# EAGLE design M705J (EAGLE 6.6.0)
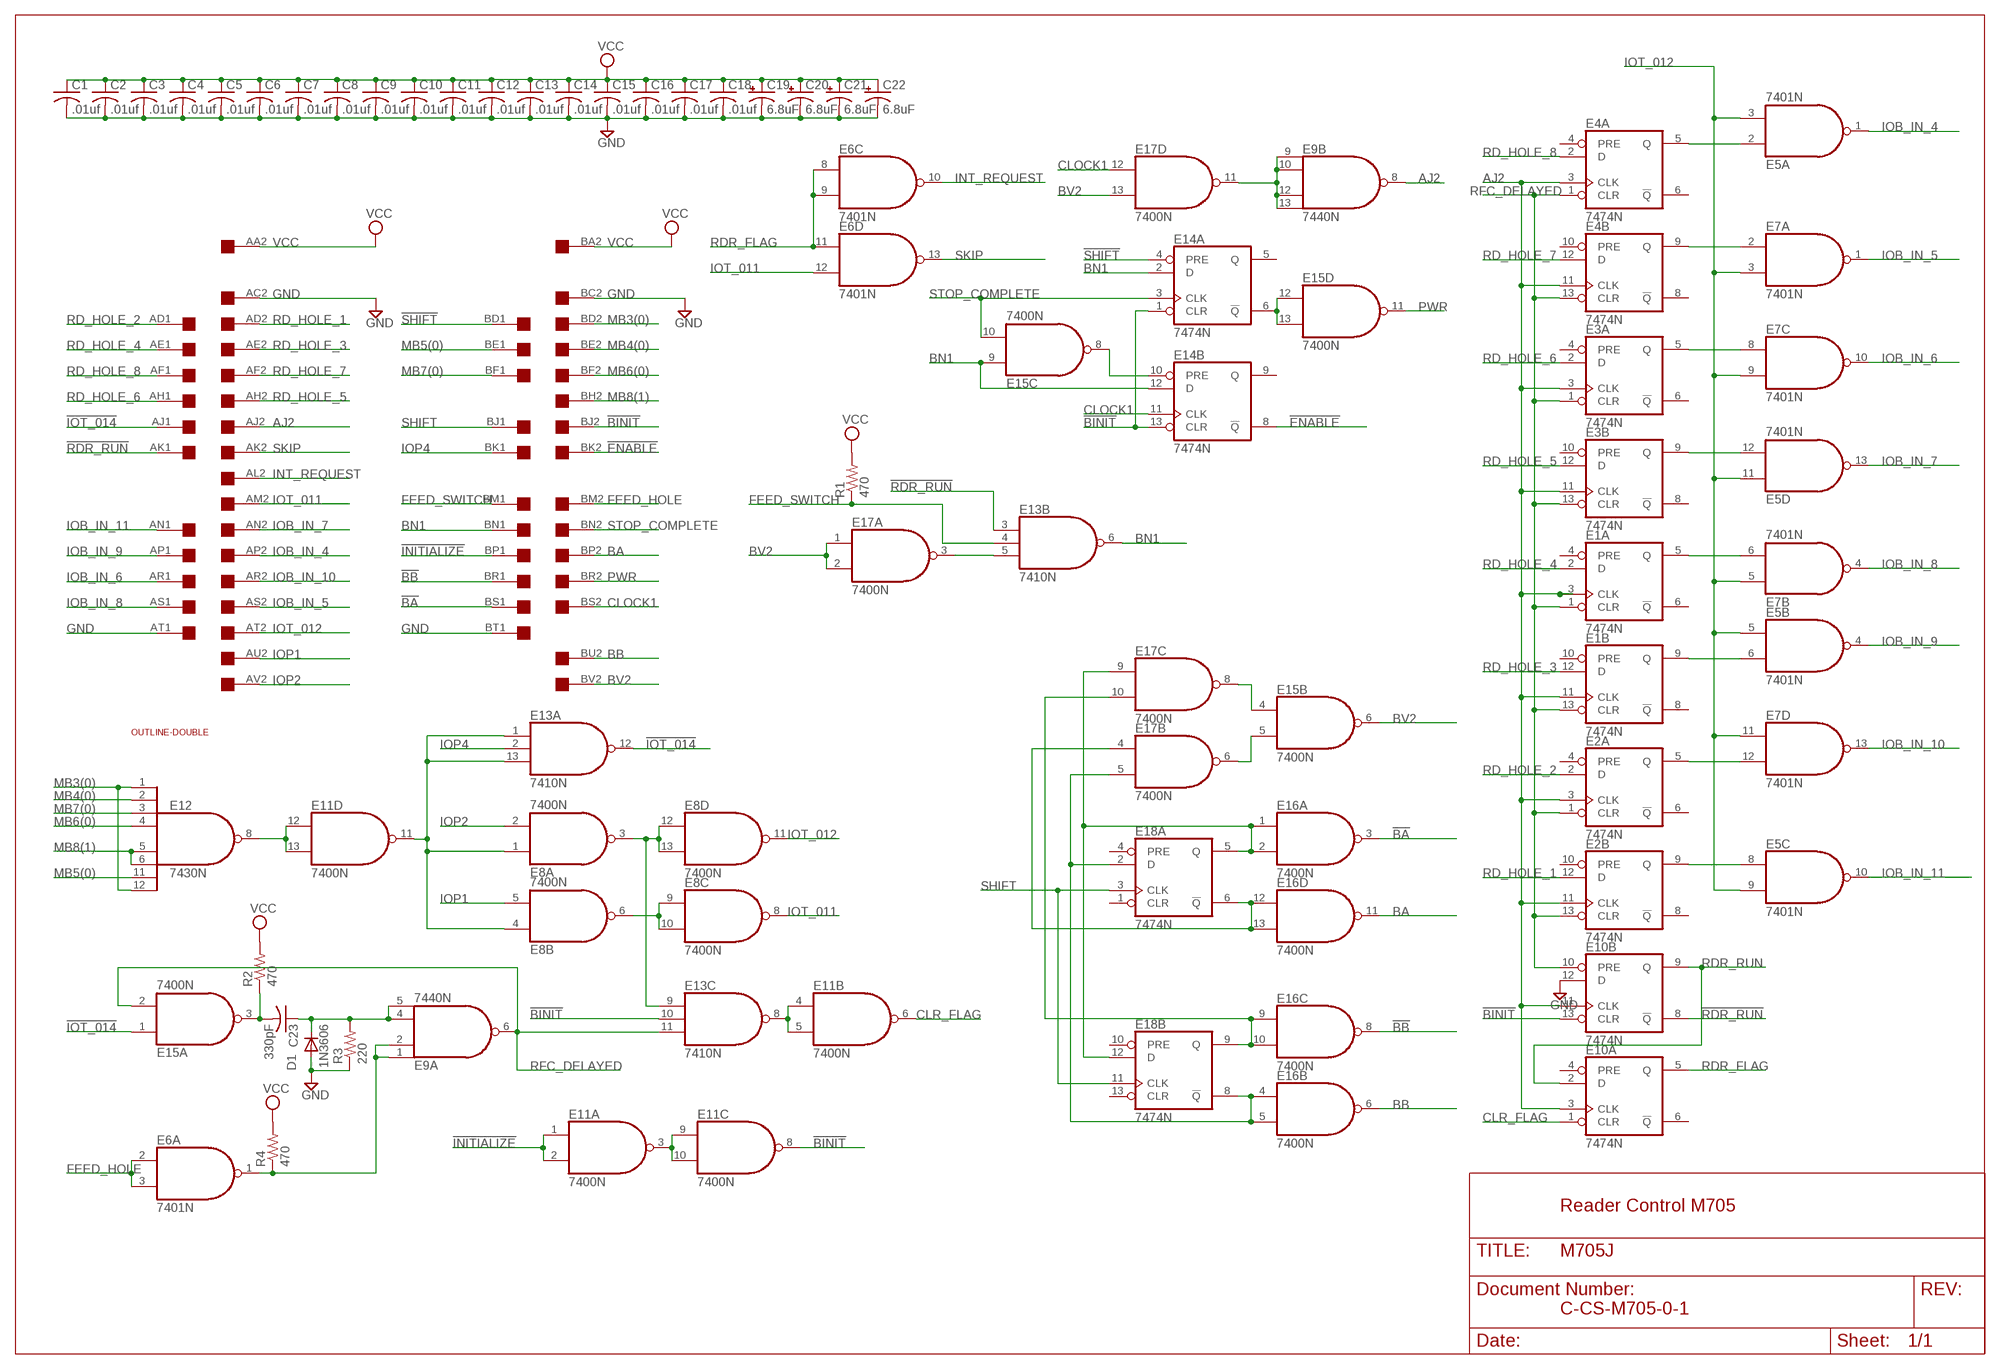
[diagram p0: schematic, sheet 1]

## Parts
C1  .01uf  C-US075-032X103  [C075-032X103]
C2  .01uf  C-US075-032X103  [C075-032X103]
C3  .01uf  C-US075-032X103  [C075-032X103]
C4  .01uf  C-US075-032X103  [C075-032X103]
C5  .01uf  C-US075-032X103  [C075-032X103]
C6  .01uf  C-US075-032X103  [C075-032X103]
C7  .01uf  C-US075-032X103  [C075-032X103]
C8  .01uf  C-US075-032X103  [C075-032X103]
C9  .01uf  C-US075-032X103  [C075-032X103]
C10  .01uf  C-US075-032X103  [C075-032X103]
C11  .01uf  C-US075-032X103  [C075-032X103]
C12  .01uf  C-US075-032X103  [C075-032X103]
C13  .01uf  C-US075-032X103  [C075-032X103]
C14  .01uf  C-US075-032X103  [C075-032X103]
C15  .01uf  C-US075-032X103  [C075-032X103]
C16  .01uf  C-US075-032X103  [C075-032X103]
C17  .01uf  C-US075-032X103  [C075-032X103]
C18  .01uf  C-US075-032X103  [C075-032X103]
C19  6.8uF  CPOL-USE20-8AXIAL  [E12-8]
C20  6.8uF  CPOL-USE20-8AXIAL  [E12-8]
C21  6.8uF  CPOL-USE20-8AXIAL  [E12-8]
C22  6.8uF  CPOL-USE20-8AXIAL  [E12-8]
C23  330pF  C-US075-032X103  [C075-032X103]
D1  1N3606  1N4148DO35-10  [DO35-10]
E1  7474N  74S74N  [DIL14]
E2  7474N  74S74N  [DIL14]
E3  7474N  74S74N  [DIL14]
E4  7474N  74S74N  [DIL14]
E5  7401N  74LS01N  [DIL14]
E6  7401N  74LS01N  [DIL14]
E7  7401N  74LS01N  [DIL14]
E8  7400N  [DIL14]
E9  7440N  74S20N  [DIL14]
E10  7474N  74S74N  [DIL14]
E11  7400N  [DIL14]
E12  7430N  [DIL14]
E13  7410N  [DIL14]
E14  7474N  74S74N  [DIL14]
E15  7400N  [DIL14]
E16  7400N  [DIL14]
E17  7400N  [DIL14]
E18  7474N  74S74N  [DIL14]
R1  470  R-US_0207/10  [0207/10]
R2  470  R-US_0207/10  [0207/10]
R3  220  R-US_0207/10  [0207/10]
R4  470  R-US_0207/10  [0207/10]
U$5  DOUBLE  [EDGE-CON4]
U$6  OUTLINE-DOUBLE  [DOUBLE]

## Nets
!BA: E16.3(A:O) U$5.BS1
!BB: E16.8(C:O) U$5.BR1
!BINIT: E10.13(B:CLR) E11.8(C:O) E13.10(C:I1) E14.1(A:CLR) E14.13(B:CLR) U$5.BJ2
!ENABLE: E14.8(B:!Q) U$5.BK2
!INITIALIZE: E11.1(A:I0) E11.2(A:I1) U$5.BP1
!IOT_014: E13.12(A:O) E15.1(A:I0) U$5.AJ1
!RDR_RUN: E10.8(B:!Q) E13.3(B:I0) U$5.AK1
!SHIFT: E14.4(A:PRE) U$5.BD1
AJ2: E1.3(A:CLK) E1.11(B:CLK) E2.3(A:CLK) E2.11(B:CLK) E3.3(A:CLK) E3.11(B:CLK) E4.3(A:CLK) E4.11(B:CLK) E9.8(B:O) E10.3(A:CLK) E10.11(B:CLK) U$5.AJ2
BA: E16.11(D:O) U$5.BP2
BB: E16.6(B:O) U$5.BU2
BN1: E13.6(B:O) E14.2(A:D) E14.12(B:D) E15.9(C:I0) U$5.BN1
BV2: E15.6(B:O) E17.1(A:I0) E17.2(A:I1) E17.13(D:I1) U$5.BV2
CLOCK1: E14.11(B:CLK) E17.12(D:I0) U$5.BS2
CLR_FLAG: E10.1(A:CLR) E11.6(B:O)
FEED_HOLE: E6.2(A:I0) E6.3(A:I1) U$5.BM2
FEED_SWITCH: E13.4(B:I1) R1.1 U$5.BM1
GND [Supply]: C1.2 C2.2 C3.2 C4.2 C5.2 C6.2 C7.2 C8.2 C9.2 C10.2 C11.2 C12.2 C13.2 C14.2 C15.2 C16.2 C17.2 C18.2 C19.- C20.- C21.- C22.- D1.A E10.12(B:D) R3.1 U$5.AC2 U$5.AT1 U$5.BC2 U$5.BT1
INT_REQUEST: E6.10(C:O) U$5.AL2
IOB_IN_4: E5.1(A:O) U$5.AP2
IOB_IN_5: E7.1(A:O) U$5.AS2
IOB_IN_6: E7.10(C:O) U$5.AR1
IOB_IN_7: E5.13(D:O) U$5.AN2
IOB_IN_8: E7.4(B:O) U$5.AS1
IOB_IN_9: E5.4(B:O) U$5.AP1
IOB_IN_10: E7.13(D:O) U$5.AR2
IOB_IN_11: E5.10(C:O) U$5.AN1
IOP1: E8.5(B:I1) U$5.AU2
IOP2: E8.2(A:I1) U$5.AV2
IOP4: E13.2(A:I1) U$5.BK1
IOT_011: E6.12(D:I1) E8.8(C:O) U$5.AM2
IOT_012: E5.3(A:I1) E5.5(B:I0) E5.9(C:I1) E5.11(D:I0) E7.3(A:I1) E7.5(B:I0) E7.9(C:I1) E7.11(D:I0) E8.11(D:O) U$5.AT2
MB3(0): E12.1(I0) E12.12(I7) U$5.BD2
MB4(0): E12.2(I1) U$5.BE2
MB5(0): E12.11(I6) U$5.BE1
MB6(0): E12.4(I3) U$5.BF2
MB7(0): E12.3(I2) U$5.BF1
MB8(1): E12.5(I4) E12.6(I5) U$5.BH2
N$1: E16.9(C:I0) E16.10(C:I1) E17.10(C:I1) E18.9(B:Q)
N$2: E4.5(A:Q) E5.2(A:I0)
N$3: E4.9(B:Q) E7.2(A:I0)
N$4: E16.12(D:I0) E16.13(D:I1) E17.4(B:I0) E18.6(A:!Q)
N$5: E11.12(D:I0) E11.13(D:I1) E12.8(O)
N$6: E8.3(A:O) E8.12(D:I0) E8.13(D:I1) E13.9(C:I0)
N$7: E8.6(B:O) E8.9(C:I0) E8.10(C:I1)
N$8: E8.1(A:I0) E8.4(B:I0) E11.11(D:O) E13.1(A:I0) E13.13(A:I2)
N$9: E3.5(A:Q) E7.8(C:I0)
N$10: E3.9(B:Q) E5.12(D:I1)
N$11: E1.5(A:Q) E7.6(B:I1)
N$12: E1.9(B:Q) E5.6(B:I1)
N$13: E2.5(A:Q) E7.12(D:I1)
N$14: E2.9(B:Q) E5.8(C:I0)
N$15: E16.4(B:I0) E16.5(B:I1) E17.5(B:I1) E18.2(A:D) E18.8(B:!Q)
N$23: E16.1(A:I0) E16.2(A:I1) E17.9(C:I0) E18.5(A:Q) E18.12(B:D)
N$24: E15.4(B:I0) E17.8(C:O)
N$25: E15.5(B:I1) E17.6(B:O)
N$26: E9.9(B:I0) E9.10(B:I1) E9.12(B:I2) E9.13(B:I3) E17.11(D:O)
N$27: E14.6(A:!Q) E15.12(D:I0) E15.13(D:I1)
N$28: E14.10(B:PRE) E15.8(C:O)
N$29: C23.2 E15.3(A:O) R2.1
N$30: C23.1 D1.C E9.4(A:I2) E9.5(A:I3) R3.2
N$31: E6.1(A:O) E9.1(A:I0) E9.2(A:I1) R4.1
N$32: E11.3(A:O) E11.9(C:I0) E11.10(C:I1)
N$33: E11.4(B:I0) E11.5(B:I1) E13.8(C:O)
N$34: E13.5(B:I2) E17.3(A:O)
PWR: E15.11(D:O) U$5.BR2
RD_HOLE_1: E2.12(B:D) U$5.AD2
RD_HOLE_2: E2.2(A:D) U$5.AD1
RD_HOLE_3: E1.12(B:D) U$5.AE2
RD_HOLE_4: E1.2(A:D) U$5.AE1
RD_HOLE_5: E3.12(B:D) U$5.AH2
RD_HOLE_6: E3.2(A:D) U$5.AH1
RD_HOLE_7: E4.12(B:D) U$5.AF2
RD_HOLE_8: E4.2(A:D) U$5.AF1
RDR_FLAG: E6.8(C:I0) E6.9(C:I1) E6.11(D:I0) E10.5(A:Q)
RDR_RUN: E10.2(A:D) E10.9(B:Q)
RFC_DELAYED: E1.1(A:CLR) E1.13(B:CLR) E2.1(A:CLR) E2.13(B:CLR) E3.1(A:CLR) E3.13(B:CLR) E4.1(A:CLR) E4.13(B:CLR) E9.6(A:O) E10.10(B:PRE) E13.11(C:I2) E15.2(A:I1)
SHIFT: E18.3(A:CLK) E18.11(B:CLK) U$5.BJ1
SKIP: E6.13(D:O) U$5.AK2
STOP_COMPLETE: E14.3(A:CLK) E15.10(C:I1) U$5.BN2
VCC [Supply]: C1.1 C2.1 C3.1 C4.1 C5.1 C6.1 C7.1 C8.1 C9.1 C10.1 C11.1 C12.1 C13.1 C14.1 C15.1 C16.1 C17.1 C18.1 C19.+ C20.+ C21.+ C22.+ R1.2 R2.2 R4.2 U$5.AA2 U$5.BA2
Unconnected: E1.4(A:PRE) E1.6(A:!Q) E1.8(B:!Q) E1.10(B:PRE) E2.4(A:PRE) E2.6(A:!Q) E2.8(B:!Q) E2.10(B:PRE) E3.4(A:PRE) E3.6(A:!Q) E3.8(B:!Q) E3.10(B:PRE) E4.4(A:PRE) E4.6(A:!Q) E4.8(B:!Q) E4.10(B:PRE) E6.4(B:O) E6.5(B:I0) E6.6(B:I1) E10.4(A:PRE) E10.6(A:!Q) E14.5(A:Q) E14.9(B:Q) E18.1(A:CLR) E18.4(A:PRE) E18.10(B:PRE) E18.13(B:CLR) U$5.AA1 U$5.AB1 U$5.AB2 U$5.AC1 U$5.AL1 U$5.AM1 U$5.AU1 U$5.AV1 U$5.BA1 U$5.BB1 U$5.BB2 U$5.BC1 U$5.BH1 U$5.BL1 U$5.BL2 U$5.BT2 U$5.BU1 U$5.BV1

## Notes on the sheet
- Reader Control M705
- C-CS-M705-0-1

## Power pins joined to a net without a drawn wire
GND: E1.7(P:GND) E2.7(P:GND) E3.7(P:GND) E4.7(P:GND) E5.7(P:GND) E6.7(P:GND) E7.7(P:GND) E8.7(P:GND) E9.7(P:GND) E10.7(P:GND) E11.7(P:GND) E12.7(GND) E13.7(P:GND) E14.7(P:GND) E15.7(P:GND) E16.7(P:GND) E17.7(P:GND) E18.7(P:GND)
VCC: E1.14(P:VCC) E2.14(P:VCC) E3.14(P:VCC) E4.14(P:VCC) E5.14(P:VCC) E6.14(P:VCC) E7.14(P:VCC) E8.14(P:VCC) E9.14(P:VCC) E10.14(P:VCC) E11.14(P:VCC) E12.14(VCC) E13.14(P:VCC) E14.14(P:VCC) E15.14(P:VCC) E16.14(P:VCC) E17.14(P:VCC) E18.14(P:VCC)

## Library data of the parts
C1-C18 C23 = rcl:C-US: CAPACITOR, American symbol
C19-C22 = dec-con:CPOL-USE20-8AXIAL: A 0.8 inch electrolytic.
D1 = diode:1N4148: DIODE high speed (Philips)
E1-E4 E10 E14 E18 = 74xx-us:74*74: Dual D type positive edge triggered FLIP FLOP, preset and clear
E5-E7 = 74xx-us:74*01: Quad 2-input NAND gate, open collector
E8 E11 E15-E17 = 74xx-us:74*00: Quad 2-input NAND gate
E9 = 74xx-us:74*20: Dual 4-input NAND gate
E12 = 74xx-us:74*30: 8-input NAND gate
E13 = 74xx-us:74*10: Triple 3-input NAND gate
R1-R4 = rcl:R-US_: RESISTOR, American symbol
U$5 = dec-con:DOUBLE: Double-Height DEC board
U$6 = dec-con:OUTLINE-*: Board outlines for DEC boards.

## Net classes
1 Supply: width 0.813 mm

## Board
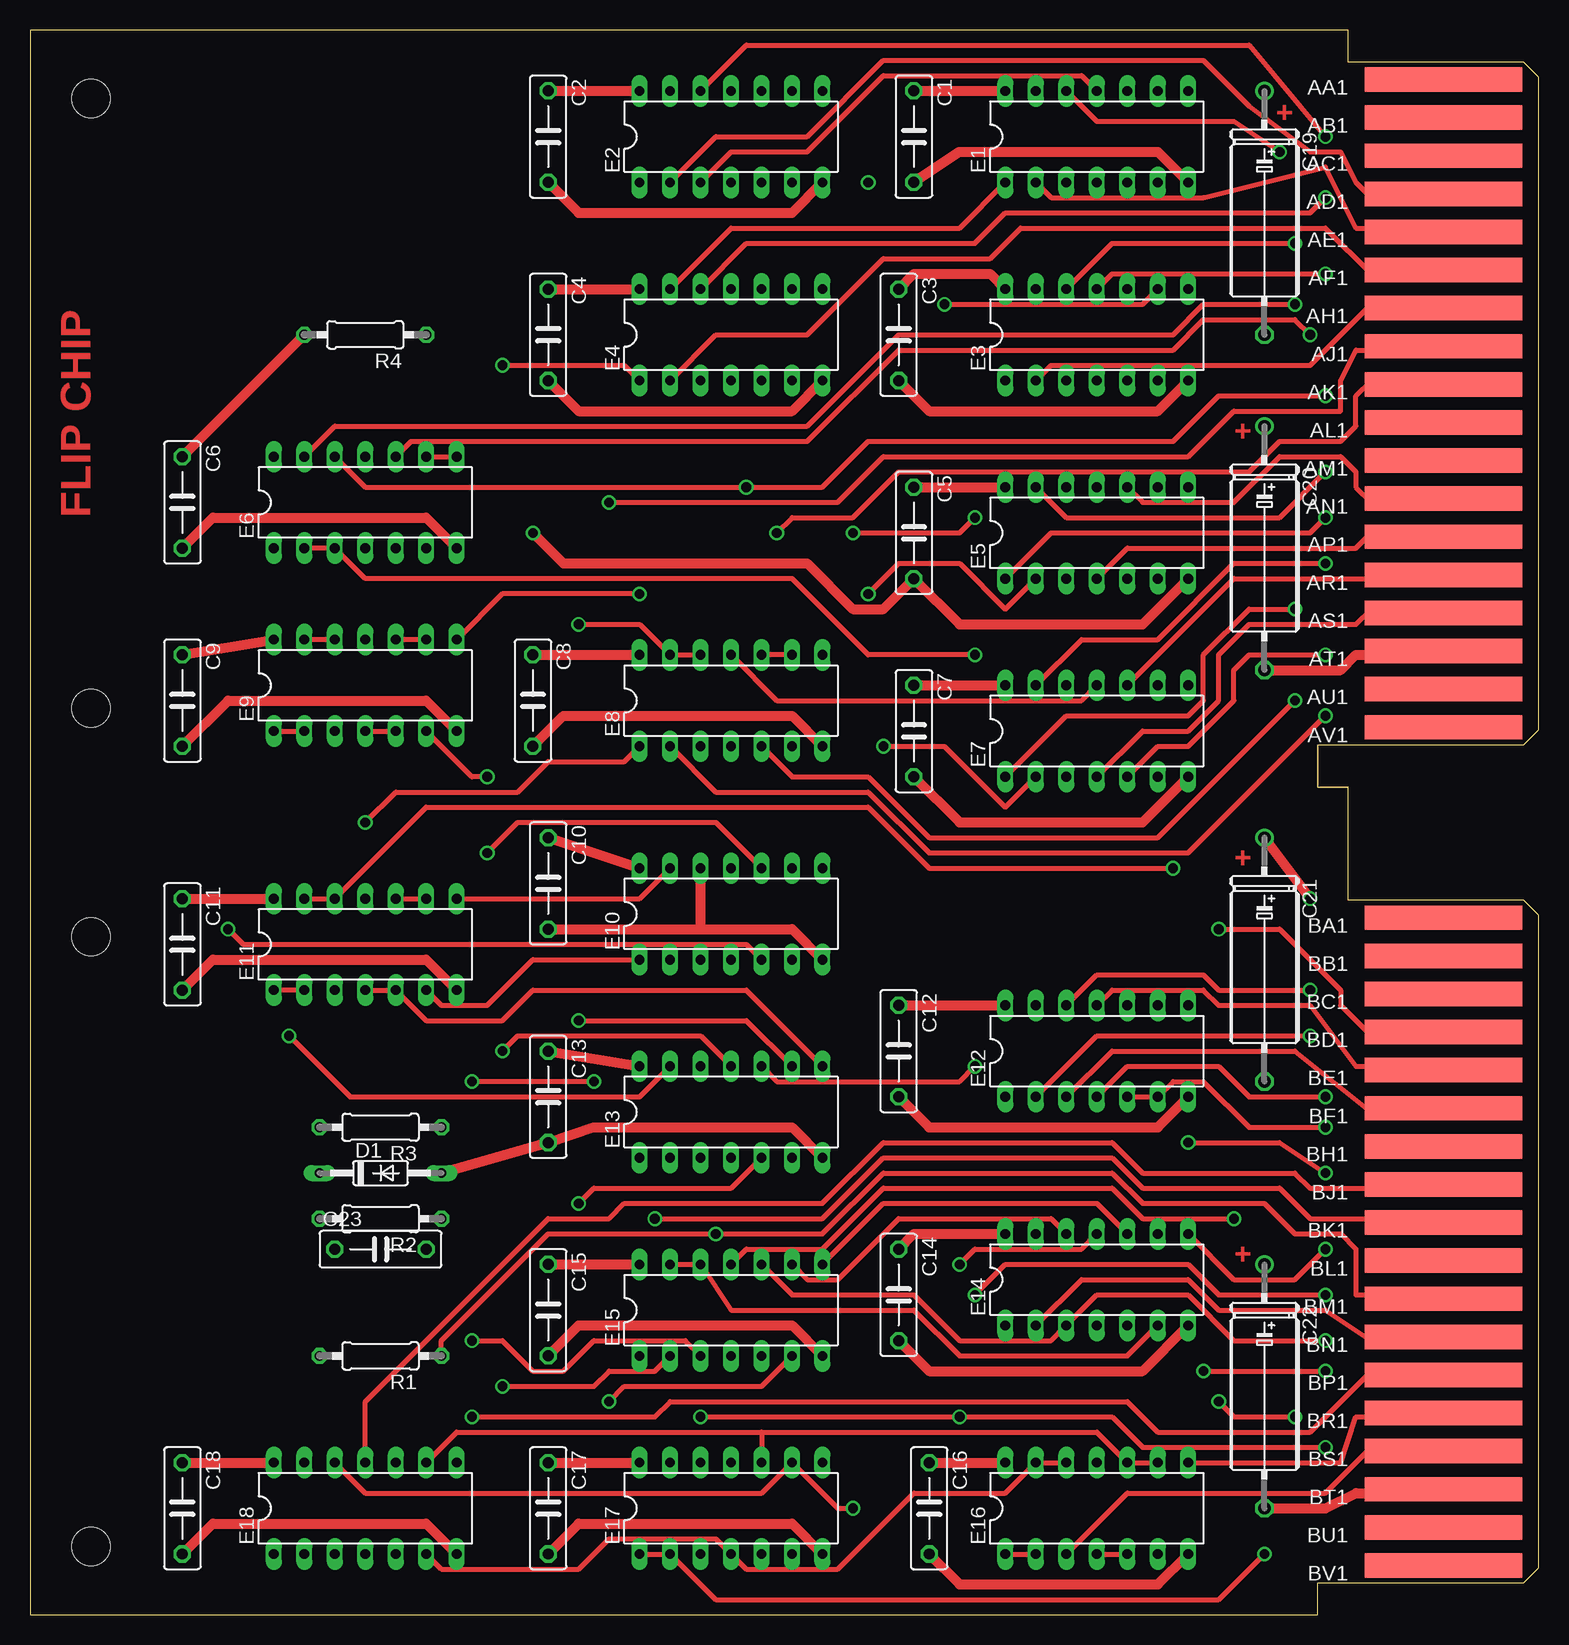
[diagram p1: board, top side]
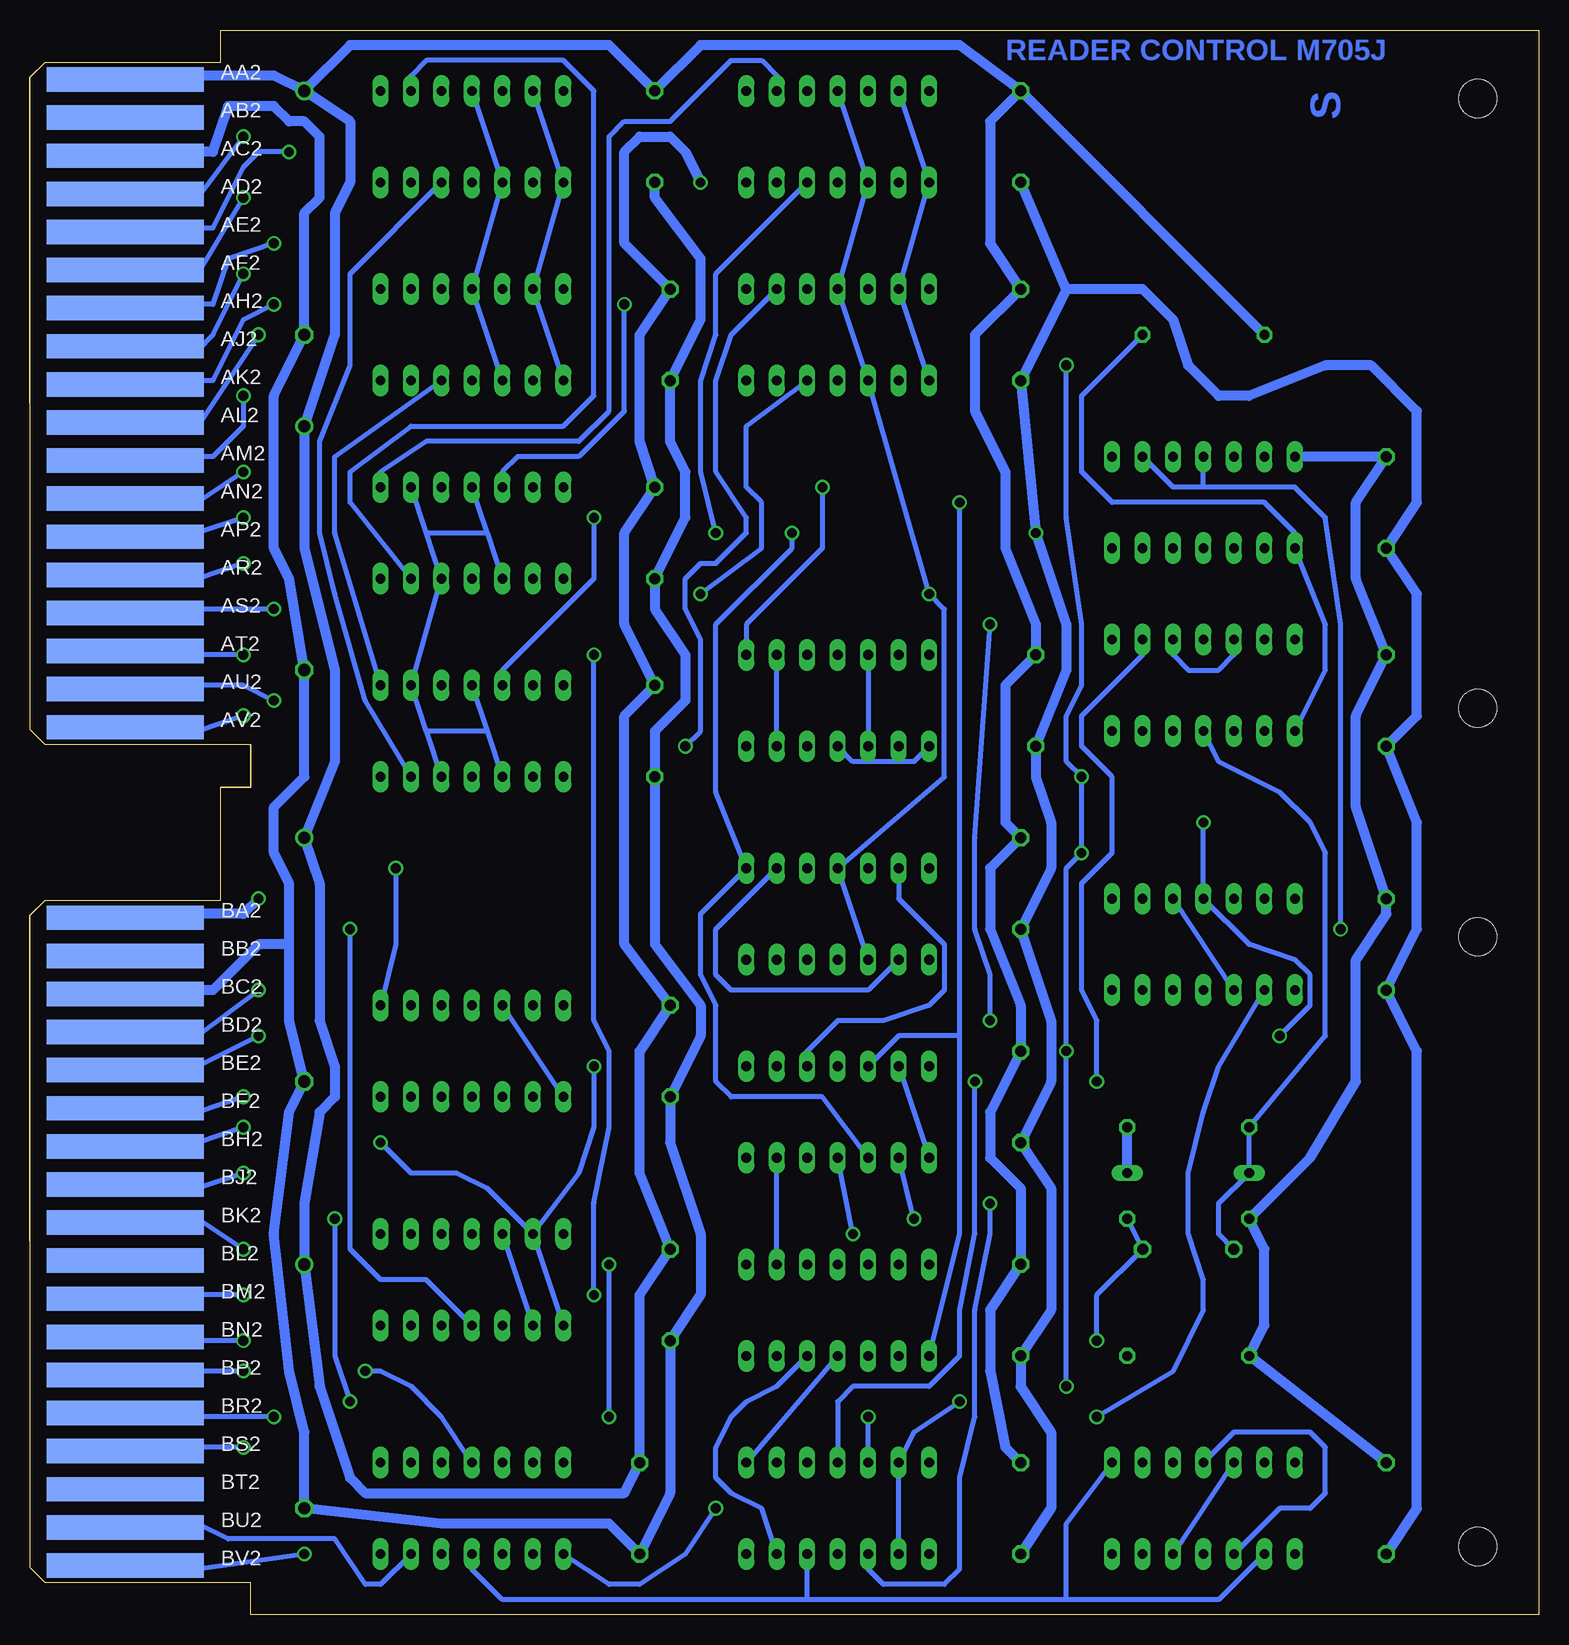
[diagram p2: board, bottom side, seen from below]

Size 125.73 x 132.08 mm. Coordinates in mm from the lower left corner, seen from the top.
Copper layers (1+16): Top 0.035mm / dielectric 1.5mm / Bottom 0.035mm
Design rules "16mils": minimum track width 16mil, minimum drill 32mil, track to track 15mil, track to pad 10mil, pad to pad 10mil, via to via 10mil, smd to smd 10mil, copper to edge 13mil, drill to drill 10mil, minimum pad ring 10mil, minimum via ring 8mil, stop-mask expansion 0mil, vias tented up to drill 0mil, thermal gap 10mil

### Footprints (pad centres in the part's own frame; a part is rotated, then mirrored left to right if it is on the bottom)
C075-032X103 = drill 0.914 octagon: 1 -3.81,0; 2 3.81,0
E12-8 = drill 1.016: + -10.16,0 | drill 1.016 octagon: - 10.16,0
DO35-10 = drill 0.813 long: A 5.08,0; C -5.08,0
DIL14 = drill 0.813 long: 1 -7.62,-3.81; 2 -5.08,-3.81; 3 -2.54,-3.81; 4 0,-3.81; 5 2.54,-3.81; 6 5.08,-3.81; 7 7.62,-3.81; 8 7.62,3.81; 9 5.08,3.81; 10 2.54,3.81; 11 0,3.81; 12 -2.54,3.81; 13 -5.08,3.81; 14 -7.62,3.81
0207/10 = drill 0.813 octagon: 1 -5.08,0; 2 5.08,0
EDGE-CON4 = smd 13.106 x 2.032: AA1 7.938,4.128; AB1 7.938,7.303; AC1 7.938,10.477; AD1 7.938,13.652; AE1 7.938,16.828; AF1 7.938,20.003; AH1 7.938,23.177; AJ1 7.938,26.352; AK1 7.938,29.527; AL1 7.938,32.703; AM1 7.938,35.877; AN1 7.938,39.053; AP1 7.938,42.227; AR1 7.938,45.403; AS1 7.938,48.578; AT1 7.938,51.752; AU1 7.938,54.928; AV1 7.938,58.102; BA1 7.938,73.978; BB1 7.938,77.153; BC1 7.938,80.328; BD1 7.938,83.502; BE1 7.938,86.677; BF1 7.938,89.853; BH1 7.938,93.028; BJ1 7.938,96.203; BK1 7.938,99.377; BL1 7.938,102.552; BM1 7.938,105.728; BN1 7.938,108.903; BP1 7.938,112.078; BR1 7.938,115.252; BS1 7.938,118.427; BT1 7.938,121.603; BU1 7.938,124.778; BV1 7.938,127.953 | smd 13.106 x 2.032 bottom: AA2 7.938,4.128; AB2 7.938,7.303; AC2 7.938,10.477; AD2 7.938,13.652; AE2 7.938,16.828; AF2 7.938,20.003; AH2 7.938,23.177; AJ2 7.938,26.352; AK2 7.938,29.527; AL2 7.938,32.703; AM2 7.938,35.877; AN2 7.938,39.053; AP2 7.938,42.227; AR2 7.938,45.403; AS2 7.938,48.578; AT2 7.938,51.752; AU2 7.938,54.928; AV2 7.938,58.102; BA2 7.938,73.978; BB2 7.938,77.153; BC2 7.938,80.328; BD2 7.938,83.502; BE2 7.938,86.677; BF2 7.938,89.853; BH2 7.938,93.028; BJ2 7.938,96.203; BK2 7.938,99.377; BL2 7.938,102.552; BM2 7.938,105.728; BN2 7.938,108.903; BP2 7.938,112.078; BR2 7.938,115.252; BS2 7.938,118.427; BT2 7.938,121.603; BU2 7.938,124.778; BV2 7.938,127.953
DOUBLE = hole 3.175: 120.65,56.515; 120.65,5.715; 120.65,75.565; 120.65,126.365

### Placement (x,y rotation side)
C1  73.66,123.19 270 top
C2  43.18,123.19 270 top
C3  72.39,106.68 270 top
C4  43.18,106.68 270 top
C5  73.66,90.17 270 top
C6  12.7,92.71 270 top
C7  73.66,73.66 270 top
C8  41.91,76.2 270 top
C9  12.7,76.2 270 top
C10  43.18,60.96 270 top
C11  12.7,55.88 270 top
C12  72.39,46.99 270 top
C13  43.18,43.18 270 top
C14  72.39,26.67 270 top
C15  43.18,25.4 270 top
C16  74.93,8.89 270 top
C17  43.18,8.89 270 top
C18  12.7,8.89 270 top
C19  102.87,116.84 270 top
C20  102.87,88.9 270 top
C21  102.87,54.61 270 top
C22  102.87,19.05 270 top
C23  29.21,30.48 0 top
D1  29.21,36.83 0 top
E1  88.9,123.19 0 top
E2  58.42,123.19 0 top
E3  88.9,106.68 0 top
E4  58.42,106.68 0 top
E5  88.9,90.17 0 top
E6  27.94,92.71 0 top
E7  88.9,73.66 0 top
E8  58.42,76.2 0 top
E9  27.94,77.47 0 top
E10  58.42,58.42 0 top
E11  27.94,55.88 0 top
E12  88.9,46.99 0 top
E13  58.42,41.91 0 top
E14  88.9,27.94 0 top
E15  58.42,25.4 0 top
E16  88.9,8.89 0 top
E17  58.42,8.89 0 top
E18  27.94,8.89 0 top
R1  29.21,21.59 180 top
R2  29.21,33.02 180 top
R3  29.21,40.64 180 top
R4  27.94,106.68 180 top
U$3  [FLIPCHIP]  0,72.39 0 top
U$5  125.73,132.08 180 top
U$6  125.73,132.08 180 top

### Tracks (layer width: path | path; a pad name or v marks a point on that pad's centre or on a via)
!BA
  Top 0.406: U$5.BS1 116.84,13.97 111.76,13.97 107.95,10.16 91.44,10.16 E16.3
!BB
  Top 0.406: U$5.BR1 116.84,16.51 110.49,16.51 109.22,12.7 E16.8
!BINIT  (via drill 0.81)
  Top 0.406: v96.52,39.37 104.14,39.37 v107.95,36.83 | E11.8 50.8,59.69 E10.13 | E13.10 62.23,44.45 77.47,44.45 v78.74,45.72
  Bottom 0.406: E14.13 E14.1 | U$5.BJ2 116.84,35.56 111.76,35.56 v107.95,36.83 | E13.10 60.96,46.99 58.42,49.53 54.61,49.53 50.8,50.8 49.53,52.07 49.53,55.88 53.34,59.69 E10.13 | E14.13 87.63,35.56 90.17,36.83 93.98,36.83 v96.52,39.37 | E14.13 80.01,36.83 78.74,40.64 v78.74,45.72
!ENABLE  (via drill 0.81)
  Top 0.406: v107.95,30.48 105.41,27.94 100.33,27.94 E14.8
  Bottom 0.406: U$5.BK2 116.84,33.02 111.76,33.02 v107.95,30.48
!INITIALIZE  (via drill 0.81)
  Top 0.406: E11.2 E11.1 | U$5.BP1 116.84,20.32 111.76,20.32 106.68,15.24 93.98,15.24 91.44,17.78 53.34,17.78 52.07,16.51 v36.83,16.51
  Bottom 0.406: E11.2 26.67,45.72 27.94,41.91 29.21,36.83 29.21,31.75 27.94,27.94 27.94,25.4 30.48,20.32 v36.83,16.51
!IOT_014  (via drill 0.81)
  Top 0.406: U$5.AJ1 116.84,105.41 110.49,105.41 109.22,102.87 109.22,100.33 100.33,100.33 96.52,96.52 71.12,96.52 67.31,92.71 v48.26,92.71
  Bottom 0.406: E15.1 48.26,31.75 48.26,48.26 | 48.26,48.26 53.34,48.26 E13.12 | 48.26,48.26 v48.26,92.71
!RDR_RUN  (via drill 0.81)
  Top 0.406: U$5.AK1 116.84,102.87 111.76,102.87 110.49,101.6 110.49,99.06 109.22,97.79 104.14,97.79 101.6,95.25 72.39,95.25 68.58,91.44 63.5,91.44 v62.23,90.17
  Bottom 0.406: E13.3 59.69,43.18 67.31,43.18 68.58,44.45 68.58,50.8 69.85,53.34 69.85,58.42 E10.8 68.58,68.58 68.58,82.55 62.23,88.9 v62.23,90.17
!SHIFT  (via drill 0.81)
  Top 0.406: U$5.BD1 116.84,48.26 111.76,48.26 109.22,50.8 109.22,52.07 104.14,57.15 v99.06,57.15
  Bottom 0.406: E14.4 92.71,27.94 96.52,27.94 99.06,30.48 v99.06,57.15
AJ2  (via drill 0.81)
  Top 0.406: E3.11 90.17,111.76 v107.95,111.76 | E2.3 58.42,121.92 64.77,121.92 71.12,128.27 87.63,128.27 E1.11 | E9.8 39.37,85.09 v50.8,85.09
  Bottom 0.406: E2.11 E2.3 E4.11 E4.3 v50.8,85.09 49.53,83.82 49.53,69.85 E10.11 E10.3 | E1.11 E1.3 E3.11 E3.3 | U$5.AJ2 116.84,105.41 111.76,105.41 110.49,106.68 v107.95,111.76
BA  (via drill 0.81)
  Top 0.406: v97.79,20.32 v107.95,20.32
  Bottom 0.406: U$5.BP2 116.84,20.32 v107.95,20.32 | E16.11 91.44,16.51 93.98,19.05 96.52,20.32 v97.79,20.32
BB
  Bottom 0.406: U$5.BU2 116.84,7.62 111.76,7.62 109.22,6.35 100.33,6.35 97.79,2.54 96.52,2.54 E16.6
BN1
  Top 0.406: U$5.BN1 116.84,22.86 111.76,22.86 107.95,25.4 99.06,25.4 96.52,27.94 87.63,27.94 E14.2 | E14.12 85.09,33.02 72.39,33.02 67.31,27.94 64.77,27.94 E15.9
  Bottom 0.406: E14.12 E14.2 | E15.9 E13.6
BV2  (via drill 0.81)
  Top 0.406: E17.1 E17.2 57.15,1.27 99.06,1.27 v102.87,5.08 | E15.6 60.96,19.05 49.53,19.05 v48.26,17.78
  Bottom 0.406: E17.2 E17.13 52.07,15.24 v48.26,17.78 | U$5.BV2 116.84,3.81 111.76,3.81 v102.87,5.08
CLOCK1  (via drill 0.81)
  Top 0.406: v107.95,13.97 92.71,13.97 90.17,16.51 v77.47,16.51 v55.88,16.51 | v77.47,29.21 78.74,30.48 87.63,30.48 E14.11
  Bottom 0.406: U$5.BS2 116.84,13.97 v107.95,13.97 | E17.12 v55.88,16.51 | v77.47,16.51 v77.47,29.21
CLR_FLAG
  Top 0.406: E11.6 34.29,50.8 38.1,50.8 41.91,54.61 E10.1
FEED_HOLE  (via drill 0.81)
  Top 0.406: E6.2 E6.3 27.94,86.36 63.5,86.36 69.85,80.01 v78.74,80.01 | v107.95,26.67 99.06,26.67 96.52,29.21 81.28,29.21 v78.74,26.67
  Bottom 0.406: U$5.BM2 116.84,26.67 v107.95,26.67 | v78.74,80.01 78.74,49.53 77.47,46.99 77.47,40.64 78.74,34.29 v78.74,26.67
FEED_SWITCH  (via drill 0.81)
  Top 0.406: R1.1 34.29,22.86 43.18,31.75 v57.15,31.75 66.04,31.75 71.12,36.83 90.17,36.83 92.71,34.29 102.87,34.29 105.41,31.75 109.22,31.75 110.49,30.48 110.49,26.67 116.84,26.67 U$5.BM1
  Bottom 0.406: v57.15,31.75 E13.4
GND  (via drill 0.81)
  Top 0.813: U$5.BT1 116.84,10.16 110.49,10.16 107.95,8.89 C22.- | E16.7 93.98,2.54 77.47,2.54 C16.2 | E14.7 92.71,20.32 74.93,20.32 C14.2 | E1.7 93.98,121.92 77.47,121.92 C1.2 | E2.7 63.5,116.84 45.72,116.84 C2.2 | E4.7 63.5,100.33 45.72,100.33 C4.2 | E3.7 93.98,100.33 74.93,100.33 C3.2 | E6.7 33.02,91.44 15.24,91.44 C6.2 | E11.7 33.02,54.61 15.24,54.61 C11.2 | E9.7 33.02,76.2 16.51,76.2 C9.2 | E18.7 33.02,7.62 15.24,7.62 C18.2 | E17.7 63.5,7.62 45.72,7.62 C17.2 | E7.7 92.71,66.04 77.47,66.04 C7.2 | E8.7 63.5,74.93 44.45,74.93 C8.2 | E10.7 63.5,57.15 55.88,57.15 | C10.2 55.88,57.15 | E12.7 93.98,40.64 74.93,40.64 C12.2 | E13.7 63.5,40.64 46.99,40.64 C13.2 D1.A | E15.7 63.5,24.13 45.72,24.13 C15.2 | E5.7 92.71,82.55 77.47,82.55 C5.2 71.12,83.82 68.58,83.82 64.77,87.63 44.45,87.63 v41.91,90.17 | U$5.AT1 116.84,80.01 110.49,80.01 109.22,78.74 C20.- | 55.88,57.15 E10.12
  Bottom 0.813: 39.37,110.49 C2.2 | 39.37,110.49 C4.2 v41.91,90.17 39.37,82.55 39.37,78.74 C8.2 41.91,69.85 40.64,66.04 40.64,62.23 C10.2 40.64,49.53 40.64,44.45 C13.2 40.64,35.56 40.64,25.4 C15.2 43.18,19.05 40.64,15.24 40.64,8.89 C17.2 | 39.37,110.49 33.02,110.49 30.48,107.95 29.21,104.14 26.67,101.6 24.13,101.6 17.78,104.14 13.97,104.14 10.16,100.33 10.16,92.71 C6.2 10.16,85.09 10.16,74.93 C9.2 10.16,66.04 10.16,57.15 C11.2 10.16,46.99 10.16,8.89 C18.2 | D1.A R3.1 | C1.2 73.66,118.11 69.85,113.03 69.85,107.95 C3.2 72.39,97.79 71.12,95.25 71.12,91.44 C5.2 73.66,83.82 71.12,80.01 71.12,76.2 73.66,73.66 C7.2 73.66,55.88 69.85,50.8 69.85,48.26 C12.2 72.39,39.37 69.85,31.75 69.85,26.67 C14.2 72.39,10.16 C16.2 77.47,7.62 91.44,7.62 C22.- 102.87,15.24 104.14,20.32 105.41,31.75 104.14,41.91 C21.- 104.14,49.53 104.14,55.88 | U$5.AC2 116.84,121.92 110.49,121.92 109.22,125.73 105.41,125.73 104.14,124.46 102.87,124.46 101.6,123.19 101.6,118.11 102.87,116.84 C19.- 105.41,101.6 105.41,88.9 104.14,86.36 C20.- 102.87,69.85 105.41,67.31 105.41,63.5 104.14,60.96 104.14,55.88 | U$5.BC2 116.84,52.07 110.49,52.07 106.68,55.88 104.14,55.88
INT_REQUEST  (via drill 0.81)
  Top 0.406: v106.68,106.68 105.41,107.95 97.79,107.95 95.25,105.41 72.39,105.41 64.77,97.79 31.75,97.79 E6.10
  Bottom 0.406: U$5.AL2 116.84,99.06 111.76,99.06 v106.68,106.68
IOB_IN_4  (via drill 0.81)
  Top 0.406: v107.95,91.44 106.68,90.17 85.09,90.17 E5.1
  Bottom 0.406: U$5.AP2 116.84,90.17 111.76,90.17 v107.95,91.44
IOB_IN_5  (via drill 0.81)
  Top 0.406: v105.41,83.82 101.6,83.82 97.79,80.01 97.79,76.2 96.52,74.93 86.36,74.93 E7.1
  Bottom 0.406: U$5.AS2 116.84,83.82 v105.41,83.82
IOB_IN_6
  Top 0.406: U$5.AR1 116.84,86.36 100.33,86.36 E7.10
IOB_IN_7  (via drill 0.81)
  Top 0.406: v107.95,95.25 104.14,91.44 86.36,91.44 E5.13
  Bottom 0.406: U$5.AN2 116.84,92.71 111.76,92.71 v107.95,95.25
IOB_IN_8
  Top 0.406: U$5.AS1 116.84,83.82 111.76,83.82 110.49,82.55 101.6,82.55 99.06,80.01 99.06,76.2 96.52,73.66 92.71,73.66 E7.4
IOB_IN_9
  Top 0.406: U$5.AP1 116.84,90.17 111.76,90.17 110.49,88.9 91.44,88.9 E5.4
IOB_IN_10  (via drill 0.81)
  Top 0.406: E7.13 87.63,81.28 93.98,81.28 100.33,87.63 v107.95,87.63
  Bottom 0.406: U$5.AR2 116.84,86.36 111.76,86.36 v107.95,87.63
IOB_IN_11
  Top 0.406: U$5.AN1 116.84,92.71 111.76,92.71 110.49,93.98 110.49,95.25 109.22,96.52 104.14,96.52 100.33,92.71 92.71,92.71 E5.10
IOP1  (via drill 0.81)
  Top 0.406: E8.5 63.5,69.85 69.85,69.85 74.93,64.77 93.98,64.77 v105.41,76.2
  Bottom 0.406: U$5.AU2 116.84,77.47 107.95,77.47 v105.41,76.2
IOP2  (via drill 0.81)
  Top 0.406: E8.2 57.15,68.58 69.85,68.58 74.93,63.5 96.52,63.5 v107.95,74.93
  Bottom 0.406: U$5.AV2 116.84,73.66 111.76,73.66 v107.95,74.93
IOP4  (via drill 0.81)
  Top 0.406: v52.07,33.02 66.04,33.02 71.12,38.1 90.17,38.1 92.71,35.56 104.14,35.56 106.68,33.02 116.84,33.02 U$5.BK1
  Bottom 0.406: v52.07,33.02 E13.2
IOT_011  (via drill 0.81)
  Top 0.406: E6.12 27.94,93.98 v59.69,93.98 66.04,93.98 69.85,97.79 95.25,97.79 99.06,101.6 v107.95,101.6
  Bottom 0.406: U$5.AM2 116.84,96.52 110.49,96.52 107.95,99.06 v107.95,101.6 | E8.8 66.04,82.55 59.69,88.9 v59.69,93.98
IOT_012  (via drill 0.81)
  Top 0.406: v107.95,80.01 101.6,80.01 100.33,78.74 100.33,76.2 96.52,72.39 93.98,72.39 E7.5 | E8.11 62.23,76.2 87.63,76.2 E7.11
  Bottom 0.406: 87.63,73.66 E7.3 | E7.11 87.63,73.66 | 92.71,73.66 E7.5 | 92.71,73.66 E7.9 E5.5 92.71,90.17 | 87.63,73.66 92.71,73.66 | 87.63,90.17 E5.3 | 92.71,90.17 87.63,90.17 | 92.71,90.17 E5.9 | 87.63,90.17 E5.11 | U$5.AT2 116.84,80.01 v107.95,80.01
MB3(0)  (via drill 0.81)
  Top 0.406: E12.12 88.9,53.34 97.79,53.34 99.06,52.07 v106.68,52.07
  Bottom 0.406: E12.1 E12.12 | U$5.BD2 116.84,48.26 111.76,48.26 v106.68,52.07
MB4(0)  (via drill 0.81)
  Top 0.406: E12.2 88.9,48.26 v106.68,48.26
  Bottom 0.406: U$5.BE2 116.84,45.72 111.76,45.72 v106.68,48.26
MB5(0)
  Top 0.406: U$5.BE1 116.84,45.72 110.49,45.72 106.68,50.8 99.06,50.8 97.79,52.07 90.17,52.07 E12.11
MB6(0)  (via drill 0.81)
  Top 0.406: v107.95,43.18 101.6,43.18 99.06,45.72 91.44,45.72 E12.4
  Bottom 0.406: U$5.BF2 116.84,41.91 111.76,41.91 v107.95,43.18
MB7(0)
  Top 0.406: U$5.BF1 116.84,41.91 111.76,41.91 105.41,46.99 90.17,46.99 E12.3
MB8(1)  (via drill 0.81)
  Top 0.406: E12.5 E12.6 95.25,44.45 97.79,44.45 101.6,40.64 v107.95,40.64
  Bottom 0.406: U$5.BH2 116.84,39.37 111.76,39.37 v107.95,40.64
N$1
  Top 0.406: E16.9 E16.10 88.9,15.24 60.96,15.24 | 60.96,15.24 E17.10 | E18.9 35.56,15.24 60.96,15.24
N$2  (via drill 0.81)
  Top 0.406: E5.2 81.28,83.82 77.47,87.63 72.39,87.63 v69.85,85.09
  Bottom 0.406: E4.5 66.04,99.06 66.04,93.98 64.77,92.71 64.77,88.9 v69.85,85.09
N$3  (via drill 0.81)
  Top 0.406: E7.2 81.28,67.31 76.2,72.39 v71.12,72.39
  Bottom 0.406: E4.9 67.31,106.68 68.58,102.87 68.58,95.25 66.04,91.44 66.04,90.17 68.58,87.63 69.85,87.63 71.12,86.36 71.12,83.82 69.85,81.28 69.85,73.66 v71.12,72.39
N$4
  Top 0.406: E16.12 E16.13 81.28,10.16 73.66,10.16 67.31,3.81 59.69,3.81 E17.4 57.15,6.35 48.26,6.35 45.72,3.81 34.29,3.81 E18.6
N$5  (via drill 0.81)
  Top 0.406: E11.13 E11.12 33.02,67.31 69.85,67.31 74.93,62.23 v95.25,62.23
  Bottom 0.406: E12.8 95.25,55.88 v95.25,62.23
N$6  (via drill 0.81)
  Top 0.406: E8.12 E8.13 50.8,82.55 v45.72,82.55 | E13.9 59.69,49.53 v45.72,49.53
  Bottom 0.406: E8.12 E8.3 | v45.72,49.53 45.72,53.34 46.99,57.15 46.99,64.77 v45.72,82.55
N$7
  Top 0.406: E8.9 E8.10
  Bottom 0.406: E8.6 E8.9
N$8  (via drill 0.81)
  Top 0.406: v21.59,48.26 26.67,43.18 50.8,43.18 E13.13 | v27.94,66.04 30.48,68.58 40.64,68.58 43.18,71.12 49.53,71.12 E8.1
  Bottom 0.406: E13.13 E13.1 | E8.1 52.07,71.12 57.15,71.12 E8.4 | v27.94,66.04 E11.11 24.13,55.88 20.32,54.61 19.05,53.34 19.05,50.8 v21.59,48.26
N$9
  Bottom 0.406: E3.5 100.33,96.52 100.33,90.17 E7.8
N$10  (via drill 0.81)
  Top 0.406: E3.9 92.71,109.22 v76.2,109.22
  Bottom 0.406: E5.12 86.36,95.25 85.09,96.52 80.01,96.52 76.2,100.33 v76.2,109.22
N$11
  Bottom 0.406: E7.6 97.79,76.2 100.33,85.09 101.6,90.17 101.6,97.79 99.06,104.14 99.06,111.76 E1.5
N$12
  Bottom 0.406: E1.9 93.98,128.27 92.71,129.54 81.28,129.54 78.74,127 78.74,101.6 81.28,99.06 93.98,99.06 99.06,95.25 99.06,92.71 E5.6
N$13  (via drill 0.81)
  Top 0.406: v78.74,91.44 77.47,90.17 v68.58,90.17
  Bottom 0.406: E2.5 68.58,111.76 68.58,106.68 69.85,102.87 69.85,95.25 v68.58,90.17 | E7.12 86.36,78.74 78.74,86.36 v78.74,91.44
N$14
  Bottom 0.406: E2.9 63.5,128.27 64.77,129.54 67.31,129.54 72.39,124.46 76.2,124.46 77.47,123.19 77.47,100.33 80.01,97.79 92.71,97.79 96.52,95.25 E5.8
N$15
  Top 0.406: E16.4 E16.5
  Bottom 0.406: E16.4 88.9,3.81 86.36,1.27 60.96,1.27 | 60.96,1.27 E17.5 | E18.8 39.37,7.62 39.37,1.27 | 39.37,1.27 60.96,1.27 | E18.2 26.67,1.27 39.37,1.27
N$23  (via drill 0.81)
  Top 0.406: E16.1 E16.2 | v68.58,8.89 67.31,8.89 E17.9 60.96,10.16 27.94,10.16 E18.12
  Bottom 0.406: E18.5 E18.12 | E16.1 77.47,2.54 74.93,2.54 71.12,5.08 v68.58,8.89
N$24
  Bottom 0.406: E15.4 E17.8
N$25
  Bottom 0.406: E17.6 64.77,8.89 67.31,10.16 68.58,11.43 68.58,13.97 67.31,16.51 66.04,17.78 63.5,19.05 E15.5
N$26  (via drill 0.81)
  Top 0.406: E9.12 E9.13 | E9.9 E9.10 | v46.99,44.45 v36.83,44.45
  Bottom 0.406: E9.12 25.4,80.01 26.67,78.74 29.21,78.74 30.48,80.01 E9.10 | E17.11 58.42,17.78 57.15,19.05 50.8,19.05 48.26,21.59 48.26,25.4 46.99,31.75 v46.99,44.45 | E9.9 33.02,80.01 38.1,74.93 38.1,72.39 35.56,69.85 35.56,63.5 38.1,60.96 38.1,52.07 36.83,49.53 v36.83,44.45
N$27
  Top 0.406: E14.6 91.44,21.59 77.47,21.59 73.66,25.4 58.42,25.4 E15.12 E15.13
N$28
  Top 0.406: E14.10 88.9,34.29 71.12,34.29 E15.8
N$29  (via drill 0.81)
  Top 0.406: v36.83,22.86 39.37,22.86 41.91,20.32 44.45,20.32 46.99,22.86 54.61,22.86 E15.3
  Bottom 0.406: v36.83,22.86 36.83,26.67 C23.2 R2.1
N$30
  Top 0.406: E9.4 E9.5
  Bottom 0.406: E9.4 26.67,71.12 21.59,68.58 19.05,66.04 17.78,63.5 17.78,48.26 R3.2 D1.C 26.67,34.29 26.67,31.75 C23.1
N$31
  Top 0.406: E9.1 E9.2
  Bottom 0.406: R4.1 38.1,101.6 38.1,95.25 35.56,92.71 22.86,92.71 20.32,90.17 E6.1 17.78,82.55 17.78,78.74 E9.1
N$32
  Top 0.406: E11.10 E11.9
  Bottom 0.406: E11.3 E11.10
N$33
  Top 0.406: E11.4 E11.5 33.02,49.53 39.37,49.53 41.91,52.07 59.69,52.07 E13.8
N$34  (via drill 0.81)
  Top 0.406: v45.72,34.29 46.99,35.56 58.42,35.56 E13.5
  Bottom 0.406: E17.3 55.88,3.81 54.61,2.54 49.53,2.54 48.26,3.81 48.26,11.43 46.99,16.51 46.99,25.4 45.72,31.75 v45.72,34.29
PWR  (via drill 0.81)
  Top 0.406: E15.11 59.69,30.48 66.04,30.48 71.12,35.56 90.17,35.56 92.71,33.02 v100.33,33.02 | v99.06,17.78 100.33,16.51 v105.41,16.51
  Bottom 0.406: U$5.BR2 116.84,16.51 v105.41,16.51 | v100.33,33.02 100.33,21.59 v99.06,17.78
RD_HOLE_1  (via drill 0.81)
  Top 0.406: v107.95,123.19 101.6,130.81 59.69,130.81 E2.12
  Bottom 0.406: U$5.AD2 116.84,118.11 111.76,118.11 v107.95,123.19
RD_HOLE_2
  Top 0.406: U$5.AD1 116.84,118.11 111.76,118.11 110.49,119.38 109.22,121.92 106.68,121.92 101.6,125.73 97.79,129.54 71.12,129.54 64.77,123.19 57.15,123.19 E2.2
RD_HOLE_3  (via drill 0.81)
  Top 0.406: v104.14,121.92 100.33,124.46 88.9,124.46 E1.12
  Bottom 0.406: U$5.AE2 116.84,115.57 110.49,115.57 107.95,120.65 106.68,121.92 v104.14,121.92
RD_HOLE_4
  Top 0.406: U$5.AE1 116.84,115.57 110.49,115.57 107.95,120.65 97.79,118.11 85.09,118.11 E1.2
RD_HOLE_5  (via drill 0.81)
  Top 0.406: E3.12 90.17,114.3 v105.41,114.3
  Bottom 0.406: U$5.AH2 116.84,109.22 110.49,109.22 109.22,113.03 v105.41,114.3
RD_HOLE_6
  Top 0.406: U$5.AH1 116.84,109.22 111.76,109.22 106.68,104.14 85.09,104.14 E3.2
RD_HOLE_7  (via drill 0.81)
  Top 0.406: E4.12 59.69,114.3 78.74,114.3 81.28,116.84 106.68,116.84 v107.95,118.11
  Bottom 0.406: U$5.AF2 116.84,111.76 111.76,111.76 v107.95,118.11
RD_HOLE_8
  Top 0.406: U$5.AF1 116.84,111.76 111.76,111.76 107.95,115.57 82.55,115.57 80.01,113.03 71.12,113.03 64.77,106.68 57.15,106.68 E4.2
RDR_FLAG  (via drill 0.81)
  Top 0.406: E6.9 E6.8 | E10.5 59.69,55.88 17.78,55.88 v16.51,57.15
  Bottom 0.406: 27.94,93.98 E6.11 | 27.94,93.98 30.48,93.98 E6.9 | 27.94,93.98 20.32,93.98 17.78,91.44 16.51,82.55 v16.51,57.15
RDR_RUN
  Bottom 0.406: E10.2 55.88,52.07 67.31,52.07 68.58,53.34 68.58,57.15 E10.9
RFC_DELAYED  (via drill 0.81)
  Top 0.406: E1.1 77.47,115.57 58.42,115.57 E4.13 | E15.2 52.07,20.32 48.26,20.32 46.99,19.05 v39.37,19.05 | v39.37,46.99 40.64,48.26 55.88,48.26 E13.11 | E10.10 57.15,66.04 40.64,66.04 v38.1,63.5 | E9.6 36.83,69.85 v38.1,69.85 | v39.37,104.14 49.53,104.14 E4.1
  Bottom 0.406: E2.13 E2.1 E4.13 E4.1 | E1.13 E1.1 E3.13 E3.1 | v39.37,19.05 v39.37,46.99 39.37,62.23 v38.1,63.5 v38.1,69.85 39.37,71.12 39.37,74.93 38.1,77.47 38.1,82.55 39.37,91.44 v39.37,104.14
SHIFT
  Top 0.406: E18.11 27.94,17.78 43.18,33.02 48.26,33.02 49.53,34.29 66.04,34.29 71.12,39.37 90.17,39.37 92.71,36.83 105.41,36.83 106.68,35.56 116.84,35.56 U$5.BJ1
  Bottom 0.406: E18.3 21.59,8.89 19.05,8.89 17.78,10.16 17.78,13.97 19.05,15.24 25.4,15.24 E18.11
SKIP  (via drill 0.81)
  Top 0.406: v105.41,109.22 97.79,109.22 95.25,106.68 72.39,106.68 64.77,99.06 25.4,99.06 E6.13
  Bottom 0.406: U$5.AK2 116.84,102.87 110.49,102.87 107.95,107.95 v105.41,109.22
STOP_COMPLETE  (via drill 0.81)
  Top 0.406: E15.10 63.5,26.67 73.66,26.67 77.47,22.86 85.09,22.86 E14.3 88.9,26.67 96.52,26.67 100.33,22.86 v107.95,22.86
  Bottom 0.406: U$5.BN2 116.84,22.86 v107.95,22.86
VCC  (via drill 0.81)
  Top 0.813: E14.14 73.66,31.75 C14.1 | C17.1 E17.14 | C16.1 E16.14 | C12.1 E12.14 | C7.1 E7.14 | C5.1 E5.14 | C3.1 73.66,111.76 80.01,111.76 E3.14 | C1.1 E1.14 | C2.1 E2.14 | C4.1 E4.14 | C6.1 R4.2 | C9.1 E9.14 | C11.1 E11.14 | C18.1 E18.14 | C15.1 E15.14 | C13.1 E13.14 | C10.1 E10.14 | C8.1 E8.14 | C21.+ v106.68,59.69
  Bottom 0.813: R4.2 C2.1 | U$5.AA2 116.84,128.27 105.41,128.27 C19.+ | C19.+ 99.06,130.81 77.47,130.81 C1.1 69.85,130.81 48.26,130.81 C2.1 | E6.14 C6.1 15.24,92.71 15.24,86.36 C9.1 15.24,74.93 15.24,67.31 C11.1 12.7,58.42 15.24,54.61 15.24,44.45 19.05,38.1 R2.2 22.86,30.48 22.86,24.13 R1.2 C18.1 | C2.1 45.72,124.46 45.72,114.3 C4.1 46.99,106.68 46.99,100.33 44.45,95.25 44.45,88.9 41.91,82.55 C8.1 44.45,77.47 44.45,66.04 C10.1 45.72,62.23 45.72,57.15 43.18,50.8 C13.1 45.72,41.91 45.72,38.1 43.18,35.56 C15.1 45.72,25.4 45.72,20.32 44.45,13.97 C17.1 | v69.85,119.38 71.12,121.92 72.39,123.19 74.93,123.19 76.2,121.92 76.2,114.3 C3.1 74.93,106.68 74.93,97.79 C5.1 76.2,90.17 76.2,82.55 C7.1 76.2,74.93 76.2,55.88 C12.1 74.93,46.99 74.93,36.83 C14.1 74.93,26.67 C16.1 76.2,10.16 97.79,10.16 99.06,11.43 101.6,19.05 C22.+ 102.87,34.29 101.6,41.91 100.33,43.18 100.33,45.72 101.6,49.53 101.6,60.96 C21.+ 100.33,71.12 100.33,78.74 102.87,88.9 C20.+ 100.33,106.68 100.33,116.84 99.06,119.38 99.06,124.46 C19.+ | U$5.BA2 116.84,58.42 107.95,58.42 v106.68,59.69

### Text on the board
Top: + | + | + | +
Bottom: READER CONTROL M705J | S